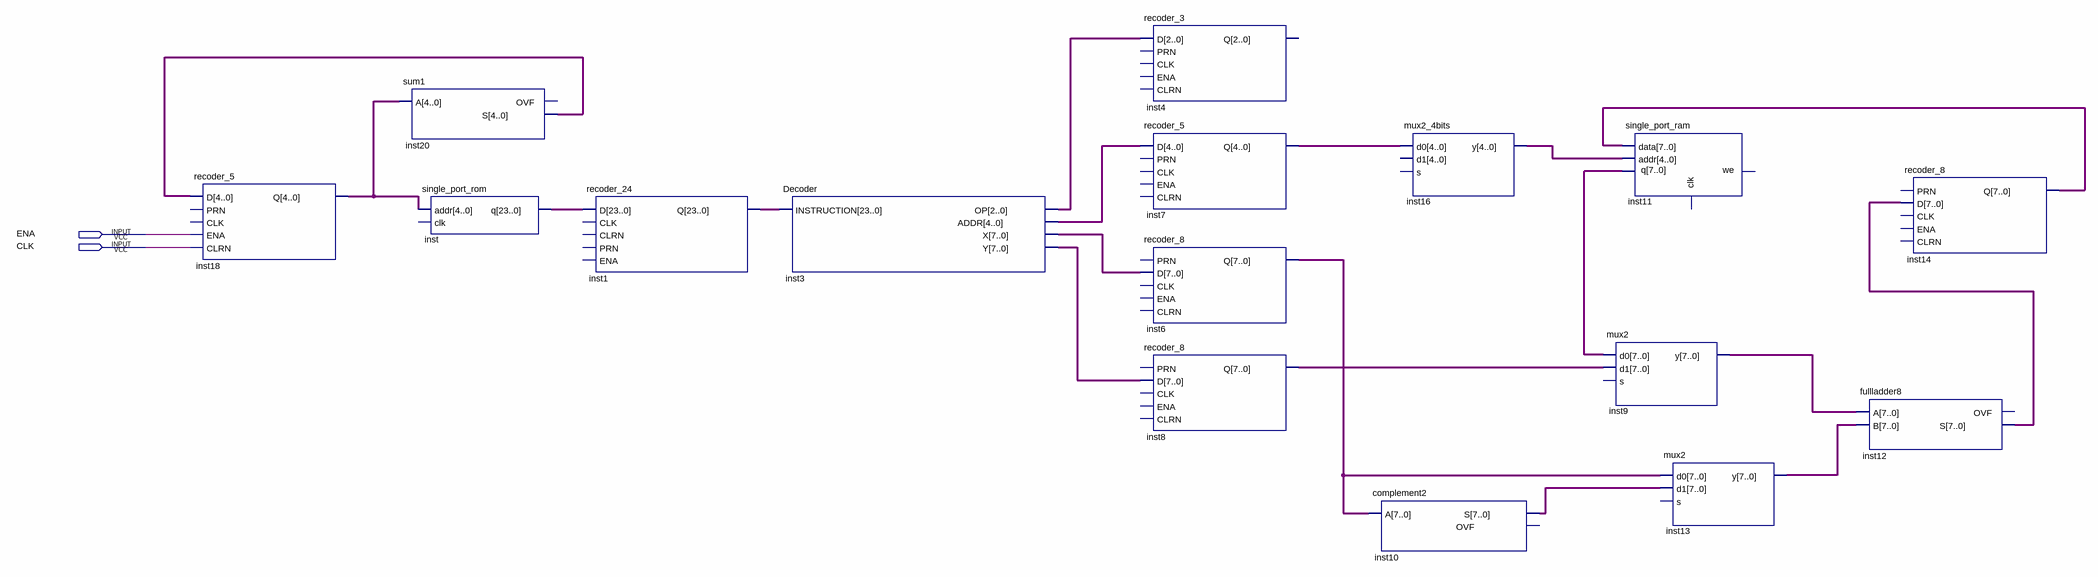
[diagram p0: schematic sheet]
// Quartus schematic Nibble.bdf as structural Verilog: 16 symbols, 2 pins
module Nibble (
  input  ENA,
  input  CLK
);

  wire [2:0] inst3_op;
  wire [4:0] inst3_addr, inst7_q, inst16_y, inst18_q, inst20_s;
  wire [7:0] inst3_x, inst3_y, inst6_q, inst8_q, inst9_y, inst10_s, inst11_q, inst12_s, inst13_y, inst14_q;
  wire [23:0] inst1_q, inst_q;

  recoder_5 inst18 (.D(inst20_s), .ENA(ENA), .CLRN(CLK), .Q(inst18_q));  // open: PRN, CLK
  sum1 inst20 (.A(inst18_q), .S(inst20_s));  // open: OVF
  single_port_rom inst (.addr(inst18_q), .q(inst_q));  // open: clk
  recoder_24 inst1 (.D(inst_q), .Q(inst1_q));  // open: CLK, CLRN, PRN, ENA
  Decoder inst3 (.INSTRUCTION(inst1_q), .OP(inst3_op), .ADDR(inst3_addr), .X(inst3_x), .Y(inst3_y));
  recoder_3 inst4 (.D(inst3_op));  // open: PRN, CLK, ENA, CLRN, Q
  recoder_5 inst7 (.D(inst3_addr), .Q(inst7_q));  // open: PRN, CLK, ENA, CLRN
  recoder_8 inst6 (.D(inst3_x), .Q(inst6_q));  // open: PRN, CLK, ENA, CLRN
  recoder_8 inst8 (.D(inst3_y), .Q(inst8_q));  // open: PRN, CLK, ENA, CLRN
  mux2_4bits inst16 (.d0(inst7_q), .y(inst16_y));  // open: d1, s
  complement2 inst10 (.A(inst6_q), .S(inst10_s));  // open: OVF
  mux2 inst9 (.d0(inst11_q), .d1(inst8_q), .y(inst9_y));  // open: s
  single_port_ram inst11 (.data(inst14_q), .addr(inst16_y), .q(inst11_q));  // open: we, clk
  mux2 inst13 (.d0(inst6_q), .d1(inst10_s), .y(inst13_y));  // open: s
  fullladder8 inst12 (.A(inst9_y), .B(inst13_y), .S(inst12_s));  // open: OVF
  recoder_8 inst14 (.D(inst12_s), .Q(inst14_q));  // open: PRN, CLK, ENA, CLRN
endmodule
